# Altium schematic sheet CAN.SchDoc
size A; SheetNumber: 17; SheetTotal: 25
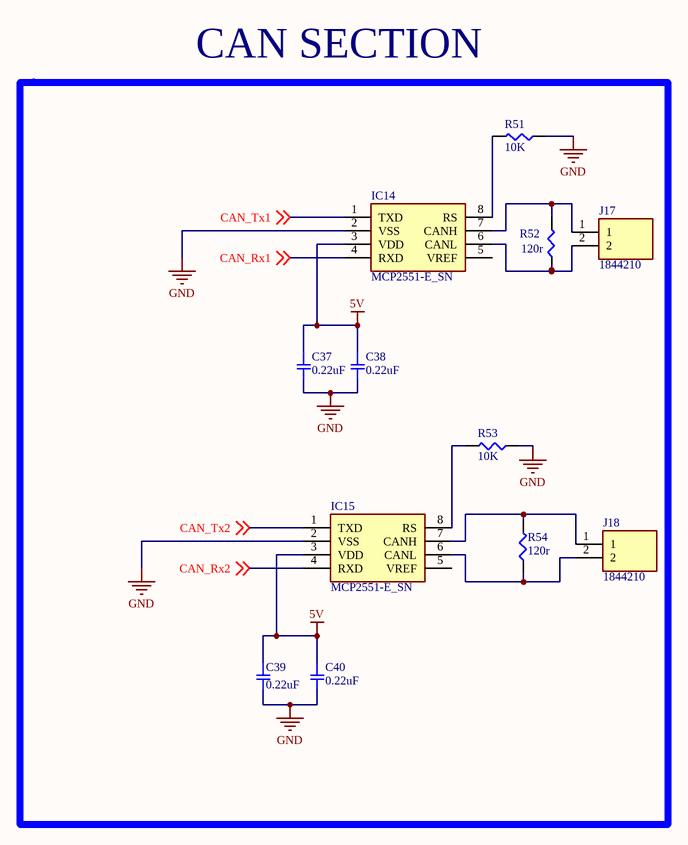
[diagram p0: CAN.SchDoc]

## Parts
C37  0.22uF  [SMD-0805C]
C38  0.22uF  [SMD-0805C]
C39  0.22uF  [SMD-0805C]
C40  0.22uF  [SMD-0805C]
IC14  MCP2551-E_SN  [SOIC127P600X175-8N]
IC15  MCP2551-E_SN  [SOIC127P600X175-8N]
J17  1844210  [SHDRRA2W80P0X350_1X2_840X920X825P]
J18  1844210  [SHDRRA2W80P0X350_1X2_840X920X825P]
R51  10K  [SMD-0805-RES]
R52  120r  [SMD-0805-RES]
R53  10K  [SMD-0805-RES]
R54  120r  [SMD-0805-RES]

## Blocks framed on the sheet
CAN SECTION: C37-C40 IC14 IC15 J17 J18 R51-R54

## Nets
5V: C37.1 C38.1 C39.1 C40.1 IC14.3(VDD) IC15.3(VDD)
GND: C37.2 C38.2 C39.2 C40.2 IC14.2(VSS) IC15.2(VSS) R51.1 R53.1
CAN_Rx1: IC14.4(RXD) ; off-sheet CAN_Rx1
CAN_Rx2: IC15.4(RXD) ; off-sheet CAN_Rx2
CAN_Tx1: IC14.1(TXD) ; off-sheet CAN_Tx1
CAN_Tx2: IC15.1(TXD) ; off-sheet CAN_Tx2
NetIC14_6: IC14.6(CANL) J17.2 R52.1
NetIC14_7: IC14.7(CANH) J17.1 R52.2
NetIC14_8: IC14.8(RS) R51.2
NetIC15_6: IC15.6(CANL) J18.2 R54.1
NetIC15_7: IC15.7(CANH) J18.1 R54.2
NetIC15_8: IC15.8(RS) R53.2

Not connected (* = marked no-connect by the designer): IC14 5(VREF); IC15 5(VREF)

## Library data of the parts
C37-C40 = GCD21BR71H104KA01L: CAP CER 0.1UF 50V X7R 0805; Manufacturer: Murata Electronics North America; Factory Stock: 0; Unit Price (USD): 0.24; Minimum Quantity: 1; Value: 0.10µF; Tolerance: ±10%; Datasheets: http://www.murata.com/~/media/webrenewal/support/library/catalog/products/capacitor/mlcc/c03e.ashx; Image: //media.digikey.com/Renders/Murata%20Renders/0805%28GxM6%29.jpg; Digi-Key Part Number: 490-11955-1-ND; Part Number: GCD21BR71H104KA01L; Quantity Available: 157; @ qty: 0; Packaging: Cut Tape (CT); Series: GCD; Part Status: Active; Voltage: 50V; Temperature Coefficient: X7R; Operating Temperature: -55°C ~ 125°C; Features: -; Ratings: AEC-Q200; Applications: Automotive; Mounting Type: Surface Mount, MLCC; Package / Case: 0805 (2012 Metric); Size / Dimension: 0.079" L x 0.049" W (2.00mm x 1.25mm); Height - Seated (Max): -; Thickness (Max): 0.049" (1.25mm); Lead Spacing: -; Lead Style: -
IC14 IC15 = MCP2551-E_SN: Integrated Circuit; Manufacturer_Name: Microchip; Manufacturer_Part_Number: MCP2551-E/SN; Datasheet Link: https://datasheet.datasheetarchive.com/originals/distributors/SFDatasheet-4/sf-00090061.pdf; Height: 1.75mm; Mouser Part Number: 579-MCP2551-E/SN; Mouser Price/Stock: https://www.mouser.co.uk/ProductDetail/Microchip-Technology/MCP2551-E-SN?qs=Vn0zuzr35GHkGDCgnw0F9A%3D%3D; Arrow Part Number: MCP2551-E/SN; Arrow Price/Stock: https://www.arrow.com/en/products/mcp2551-esn/microchip-technology
J17 J18 = 1844210: Connector; Manufacturer_Name: Phoenix Contact; Datasheet Link: http://www.phoenixcontact.com/gb/produkte/1844210; Height: 8.25mm; Manufacturer_Part_Number: 1844210; Mouser Part Number: 651-1844210; Mouser Price/Stock: https://www.mouser.co.uk/ProductDetail/Phoenix-Contact/1844210?qs=8BCRtFWWXORb3OQRdxIGVQ%3D%3D; Arrow Part Number: 1844210; Arrow Price/Stock: https://www.arrow.com/en/products/1844210/phoenix-contact?region=nac
R51-R54 = ERJ-6ENF1001V: RES SMD 1K OHM 1% 1/8W 0805; Manufacturer: Panasonic Electronic Components; Factory Stock: 0; Unit Price (USD): 0.00729; @ qty: 1500; Minimum Quantity: 1; Power (Watts): 0.125W, 1/8W; Temperature Coefficient: ±100ppm/°C; Part Number: ERJ-6ENF1001V; Datasheets: http://industrial.panasonic.com/www-cgi/jvcr13pz.cgi?E+PZ+3+AOA0002+ERJ6ENF1001V+7+WW; Image: //media.digikey.com/Renders/Panasonic%20Renders/ERJ-0805%20Pkg.jpg; Digi-Key Part Number: P1.00KCCT-ND; Quantity Available: 12895103; Packaging: Cut Tape (CT); Series: ERJ; Part Status: Active; Value: 1k; Tolerance: ±1%; Composition: Thick Film; Features: Automotive AEC-Q200; Operating Temperature: -55°C ~ 155°C; Package / Case: 0805 (2012 Metric); Supplier Device Package: 0805; Size / Dimension: 0.079" L x 0.049" W (2.00mm x 1.25mm); Height - Seated (Max): 0.028" (0.70mm); Number of Terminations: 2; Failure Rate: -